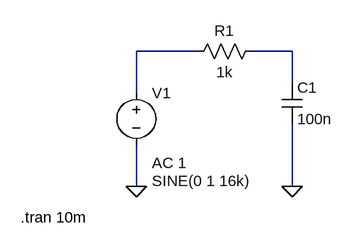
[diagram p0: schematic Draft ep2b.asc]
Draft ep2b.asc, the LTspice schematic file:
Version 4
SHEET 1 880 680
WIRE 208 48 112 48
WIRE 352 48 288 48
WIRE 352 96 352 48
WIRE 112 112 112 48
WIRE 112 256 112 192
WIRE 352 256 352 160
FLAG 112 256 0
FLAG 352 256 0
SYMBOL voltage 112 96 R0
WINDOW 3 24 152 Left 2
WINDOW 123 24 124 Left 2
WINDOW 39 0 0 Left 0
SYMATTR InstName V1
SYMATTR Value SINE(0 1 16k)
SYMATTR Value2 AC 1
SYMBOL res 304 32 R90
WINDOW 0 0 56 VBottom 2
WINDOW 3 32 56 VTop 2
SYMATTR InstName R1
SYMATTR Value 1k
SYMBOL cap 336 96 R0
SYMATTR InstName C1
SYMATTR Value 100n
TEXT -66 304 Left 2 !.tran 10m

The netlist it stands for:
* Draft ep2b.asc
V1 N001 0 SINE(0 1 16k) AC 1
R1 N002 N001 1k
C1 N002 0 100n
.tran 10m
.backanno
.end